# Altium schematic sheet Storage.SchDoc
size A4
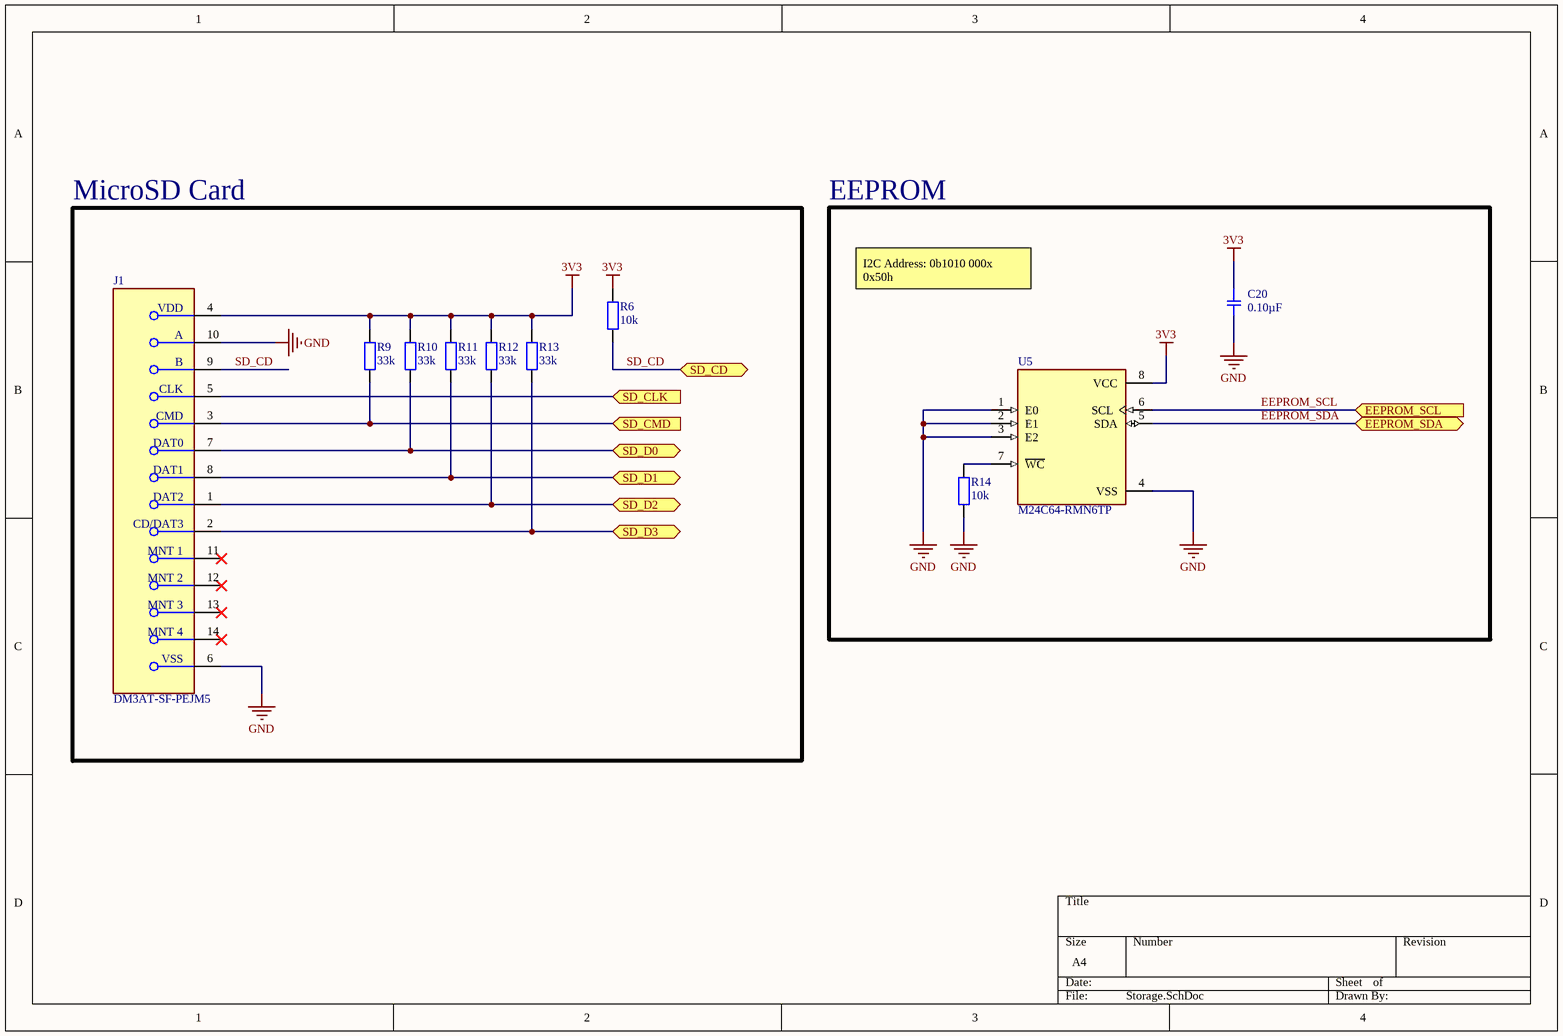
[diagram p0: Storage.SchDoc]

## Parts
C20  value 0.10µF  [SMD-0402C]  (hidden comment: GRM155R61A104KA01J)
J1  DM3AT-SF-PEJM5  [FP-DM3AT-SF-PEJM5-MFG]
R6  10k  [IPC C R0402 NO SILK]
R9  33k  [IPC C R0402 NO SILK]
R10  33k  [IPC C R0402 NO SILK]
R11  33k  [IPC C R0402 NO SILK]
R12  33k  [IPC C R0402 NO SILK]
R13  33k  [IPC C R0402 NO SILK]
R14  10k  [IPC C R0402 NO SILK]
U5  M24C64-RMN6TP  [SOIC127P600X175-8N]

## Blocks framed on the sheet
MicroSD Card: J1 R6 R9-R13
EEPROM: C20 R14 U5

## Ports
EEPROM_SCL (in), EEPROM_SDA (bidir), SD_CD (bidir), SD_CLK (in), SD_CMD (in), SD_D0 (bidir), SD_D1 (bidir), SD_D2 (bidir), SD_D3 (bidir)

## Nets
3V3: C20.1 J1.4(VDD) R6.2 R9.2 R10.2 R11.2 R12.2 R13.2 U5.8(VCC)
GND: C20.2 J1.6(VSS) J1.10(A) R14.2 U5.1(E0) U5.2(E1) U5.3(E2) U5.4(VSS)
EEPROM_SCL: U5.6(SCL) ; port EEPROM_SCL
EEPROM_SDA: U5.5(SDA) ; port EEPROM_SDA
SD_CD: J1.9(B) R6.1 ; port SD_CD
SD_CLK: J1.5(CLK) ; port SD_CLK
SD_CMD: J1.3(CMD) R9.1 ; port SD_CMD
SD_D0: J1.7(DAT0) R10.1 ; port SD_D0
SD_D1: J1.8(DAT1) R11.1 ; port SD_D1
SD_D2: J1.1(DAT2) R12.1 ; port SD_D2
SD_D3: J1.2(CD/DAT3) R13.1 ; port SD_D3
NetR14_1: R14.1 U5.7(~{WC})

Not connected (* = marked no-connect by the designer): J1 11(MNT_1)* 12(MNT_2)* 13(MNT_3)* 14(MNT_4)*

## Notes on the sheet
- I2C Address: 0b1010 000x
  0x50h

## Library data of the parts
C20 = CMP-140-000687-1: CAP CER 0.1UF 10V X5R 0402; Manufacturer: Murata Electronics North America; Factory Stock: 0; Unit Price (USD): 0.1; Minimum Quantity: 1; Tolerance: ±10%; Ratings: -; Lead Spacing: -; Source: capacitor_murata_0402$.SchLib; Part Status: Active; Pin Count: 2; Digi-Key Part Number: 490-6297-1-ND; Operating Temperature: -55°C ~ 85°C; Height - Seated (Max): -; Voltage: 10V; @ qty: 0; Temperature Coefficient: X5R; Package / Case: 0402 (1005 Metric); Size / Dimension: 0.039" L x 0.020" W (1.00mm x 0.50mm); Quantity Available: 24406; Datasheets: http://www.murata.com/~/media/webrenewal/support/library/catalog/products/capacitor/mlcc/c02e.pdf; Series: GRM; Applications: General Purpose; Thickness (Max): 0.022" (0.55mm); Image: //media.digikey.com/Renders/Murata%20Renders/ZRB-SERIES-0402.jpg; Packaging: Cut Tape (CT); Part Number: GRM155R61A104KA01J; Features: -; Component Type: Standard; Mounting Type: Surface Mount, MLCC; Design Item ID: GRM155R61A104KA01J
J1 = CMP-2000-05150-2: CONN MICRO SD CARD PUSH-PUSH R/A; Current Rating: 500mA; Number of Contacts: 8; Pitch: 1.1mm; Gender: Female; Connector Type: Connector; Max Voltage Rating (AC): 125V; Min Operating Temperature: -25°C; Length: 15.95mm; Packaging: Tape and Reel; Width: 13.85mm; Flammability Rating: UL94 V-0; Termination: SMD/SMT; Contact Material: Copper Alloy; Depth: 15.95mm; Radiation Hardening: No; Number of Rows: 1; Max Operating Temperature: 85°C; Housing Material: Polymer; Height: 1.68mm; Package Quantity: 1; Orientation: Right Angle; REACH SVHC: No SVHC; Mount: Surface Mount; Max Current Rating: 500mA; Number of Positions: 8; Lead Free: Lead Free; Contact Plating: Gold; Voltage Rating: 125V
R6 R9-R14 = CMP-009-00183-1: Design Item ID: Generic RES 0402; Source: Schlib1.SchLib
  R6 R14: Value: 10k
  R9-R13: Value: 33k
U5 = CMP-038-000000-1: Package: None; Price: None; Pin Count: 8; Availability: Unavailable; MP: M24C64-RMN6TP; Design Item ID: M24C64-RMN6TP; Source: M24C64-RMN6TP.SchLib; Value: *; Component Type: Standard